# Altium project Блок вычислительный.PrjPcb (part 2 of 2)
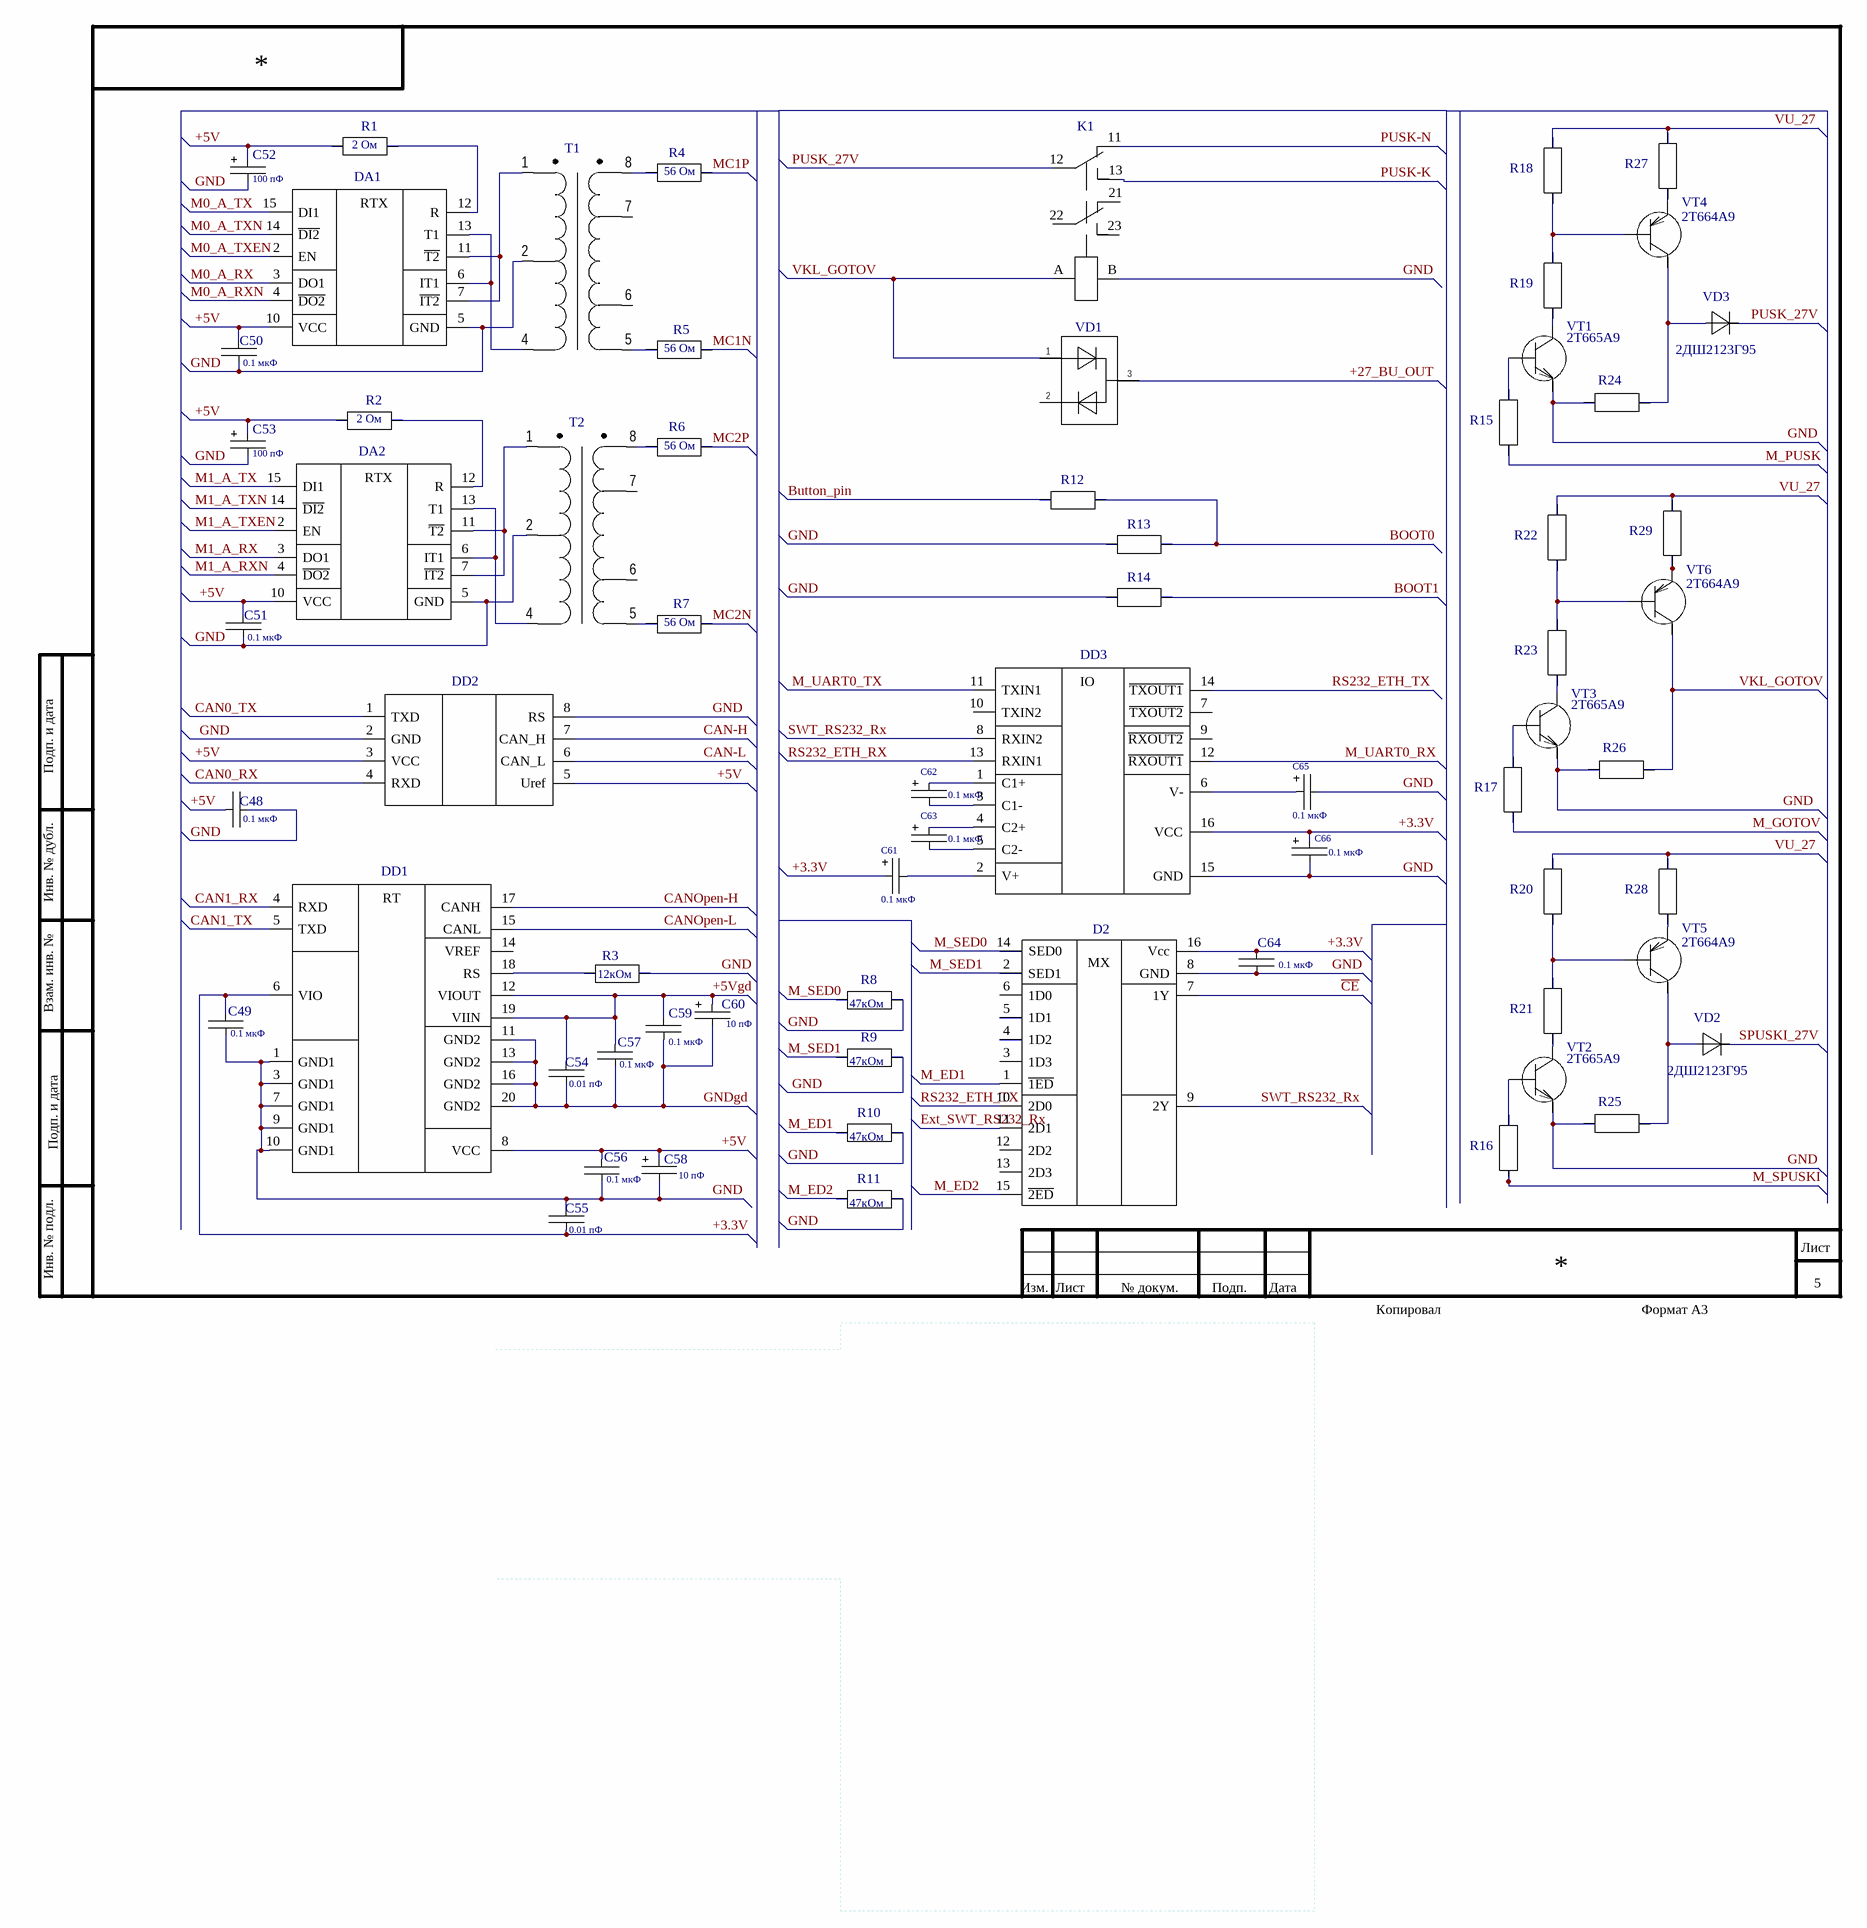
[diagram p5: InterfMCU.SchDoc]

## Nets that join several sheets
+1.2V: InternalConnection (XP13.5), MCU1 (66 pins)
+3.3V: InternalConnection (13 pins), MCU1 (70 pins), InterfMCU (8 pins)
GND: ExternalConnection (XP3.J XP6.H), InternalConnection (22 pins), MCU1 (101 pins), InterfMCU (39 pins)
+5V: InternalConnection (N51.1 N52.1 XP13.7 XS1.62), InterfMCU (14 pins)
+5VGD: InternalConnection (N53.1 N54.1 XP13.8 XS1.60), InterfMCU (6 pins)
+27_BU_OUT: InternalConnection (N49.1 N50.1 XP13.2), InterfMCU (VD1.3)
+27V_BU1-1: ExternalConnection (XP9.D), InternalConnection (X191.1)
+27V_BU1-2: ExternalConnection (XP9.E), InternalConnection (X192.1)
+27V_BU1-3: ExternalConnection (XP9.F), InternalConnection (X193.1)
+27V_BU2-1: ExternalConnection (XP9.Z), InternalConnection (X181.1)
+27V_BU2-2: ExternalConnection (XP9.mm), InternalConnection (X182.1)
+27V_BU2-3: ExternalConnection (XP9.tt), InternalConnection (X183.1)
+27V_BU3-1: ExternalConnection (XP9.S), InternalConnection (X196.1)
+27V_BU3-2: ExternalConnection (XP9.T), InternalConnection (X197.1)
+27V_BU3-3: ExternalConnection (XP9.U), InternalConnection (X198.1)
+27V_BU4-1: ExternalConnection (XP9.ii), InternalConnection (X186.1)
+27V_BU4-2: ExternalConnection (XP9.kk), InternalConnection (X187.1)
+27V_BU4-3: ExternalConnection (XP9.ss), InternalConnection (X188.1)
+27V_KMPOU-K: ExternalConnection (XP1.P), InternalConnection (VD5.2 X167.1)
+27V_KMPOU-K1: ExternalConnection (XP2.N), InternalConnection (X168.1)
+27V_KMPOU-K2: ExternalConnection (XP2.V), InternalConnection (X169.1)
+27V_KMPOU-N: ExternalConnection (XP1.A), InternalConnection (VD5.1 X164.1)
+27V_KMPOU-N1: ExternalConnection (XP3.N), InternalConnection (X165.1)
+27V_KMPOU-N2: ExternalConnection (XP3.V), InternalConnection (X166.1)
+27V_UV-K1: ExternalConnection (XP2.A), InternalConnection (X199.1)
+27V_UV-K2: ExternalConnection (XP2.P), InternalConnection (X200.1)
+27V_UV-N1: ExternalConnection (XP3.A), InternalConnection (X194.1)
+27V_UV-N2: ExternalConnection (XP3.P), InternalConnection (X195.1)
+27V_VM-K1: ExternalConnection (XP2.C), InternalConnection (X189.1)
+27V_VM-K2: ExternalConnection (XP2.L), InternalConnection (X190.1)
+27V_VM-N1: ExternalConnection (XP3.C), InternalConnection (X184.1)
+27V_VM-N2: ExternalConnection (XP3.L), InternalConnection (X185.1)
-27V_BU1-1: ExternalConnection (XP9.aa), InternalConnection (X217.1)
-27V_BU1-2: ExternalConnection (XP9.nn), InternalConnection (X218.1)
-27V_BU1-3: ExternalConnection (XP9.pp), InternalConnection (X219.1)
-27V_BU2-1: ExternalConnection (XP9.G), InternalConnection (X207.1)
-27V_BU2-2: ExternalConnection (XP9.bb), InternalConnection (X208.1)
-27V_BU2-3: ExternalConnection (XP9.cc), InternalConnection (X209.1)
-27V_BU3-1: ExternalConnection (XP9.hh), InternalConnection (X221.1)
-27V_BU3-2: ExternalConnection (XP9.qq), InternalConnection (X222.1)
-27V_BU3-3: ExternalConnection (XP9.rr), InternalConnection (X223.1)
-27V_BU4-1: ExternalConnection (XP9.R), InternalConnection (X212.1)
-27V_BU4-2: ExternalConnection (XP9.ff), InternalConnection (X213.1)
-27V_BU4-3: ExternalConnection (XP9.gg), InternalConnection (X214.1)
-27V_KMPOU-K: ExternalConnection (XP1.R), InternalConnection (X206.1)
-27V_KMPOU-N: ExternalConnection (XP1.U), InternalConnection (X205.1)
-27V_UV-K1: ExternalConnection (XP2.G), InternalConnection (X224.1)
-27V_UV-N: ExternalConnection (XP3.G), InternalConnection (X220.1)
-27V_VM-K1: ExternalConnection (XP2.R), InternalConnection (X215.1)
-27V_VM-K2: ExternalConnection (XP2.U), InternalConnection (X216.1)
-27V_VM-N1: ExternalConnection (XP3.R), InternalConnection (X210.1)
-27V_VM-N2: ExternalConnection (XP3.U), InternalConnection (X211.1)
~{BHE}: InternalConnection (D3.40), MCU2 (D1.T13)
~{BLE}: InternalConnection (D3.39), MCU2 (D1.V12)
~{CE}: InternalConnection (D3.6), MCU2 (D1.V8), InterfMCU (D2.7)
~{OE}: InternalConnection (D3.41), MCU2 (D1.V17)
~{WE}: InternalConnection (D3.17), MCU2 (D1.U17)
BOOT0: MCU1 (D1.P3), InterfMCU (R12.2 R13.2)
BOOT1: MCU1 (D1.P4), InterfMCU (R14.2)
Button_pin: InternalConnection (N13.1 N14.1 XS1.55), InterfMCU (R12.1)
CAN0_RX: MCU2 (D1.J5), InterfMCU (DD2.4)
CAN0_TX: MCU2 (D1.H3), InterfMCU (DD2.1)
CAN1_RX: MCU2 (D1.J2), InterfMCU (DD1.4)
CAN1_TX: MCU2 (D1.J4), InterfMCU (DD1.5)
CAN-H: ExternalConnection (XP3.K XP6.G), InternalConnection (N15.1 N16.1 XS1.53), InterfMCU (DD2.7)
CAN-L: ExternalConnection (XP3.H XP6.A), InternalConnection (N17.1 N18.1 XS1.54), InterfMCU (DD2.6)
CANOpen-H: ExternalConnection (XP10.B XP10.E), InternalConnection (N19.1 N20.1), InterfMCU (DD1.17)
CANOpen-L: ExternalConnection (XP10.A XP10.C), InternalConnection (N21.1 N22.1), InterfMCU (DD1.15)
EKRAN_1: ExternalConnection (XP1.S), InternalConnection (X201.1)
EKRAN_2: ExternalConnection (XP2.S), InternalConnection (X202.1)
EKRAN_3: ExternalConnection (XP3.S), InternalConnection (X203.1)
EKRAN_4: ExternalConnection (XP6.F), InternalConnection (X204.1)
EXT_A0: InternalConnection (D3.5 ), MCU2 (D1.P20)
EXT_A1: InternalConnection (D3.4), MCU2 (D1.N16)
EXT_A2: InternalConnection (D3.3), MCU2 (D1.N17)
EXT_A3: InternalConnection (D3.2), MCU2 (D1.N19)
EXT_A4: InternalConnection (D3.1), MCU2 (D1.N20)
EXT_A5: InternalConnection (D3.44), MCU2 (D1.M17)
EXT_A6: InternalConnection (D3.43), MCU2 (D1.M19)
EXT_A7: InternalConnection (D3.42), MCU2 (D1.M20)
EXT_A8: InternalConnection (D3.27), MCU2 (D1.L17)
EXT_A9: InternalConnection (D3.26), MCU2 (D1.L18)
EXT_A10: InternalConnection (D3.25), MCU2 (D1.L19)
EXT_A11: InternalConnection (D3.24), MCU2 (D1.L20)
EXT_A12: InternalConnection (D3.22), MCU2 (D1.K18)
EXT_A13: InternalConnection (D3.21), MCU2 (D1.K20)
EXT_A14: InternalConnection (D3.20), MCU2 (D1.J16)
EXT_A15: InternalConnection (D3.19), MCU2 (D1.J17)
EXT_A16: InternalConnection (D3.18), MCU2 (D1.U6)
EXT_D0: InternalConnection (D3.7), MCU2 (D1.S16)
EXT_D1: InternalConnection (D3.8), MCU2 (D1.S17)
EXT_D2: InternalConnection (D3.9), MCU2 (D1.U18)
EXT_D3: InternalConnection (D3.10), MCU2 (D1.V18)
EXT_D4: InternalConnection (D3.13), MCU2 (D1.V19)
EXT_D5: InternalConnection (D3.14), MCU2 (D1.V20)
EXT_D6: InternalConnection (D3.15), MCU2 (D1.T20)
EXT_D7: InternalConnection (D3.16), MCU2 (D1.T19)
EXT_D8: InternalConnection (D3.29), MCU2 (D1.S20)
EXT_D9: InternalConnection (D3.30), MCU2 (D1.S19)
EXT_D10: InternalConnection (D3.31), MCU2 (D1.R20)
EXT_D11: InternalConnection (D3.32), MCU2 (D1.R19)
EXT_D12: InternalConnection (D3.35), MCU2 (D1.Q20)
EXT_D13: InternalConnection (D3.36), MCU2 (D1.Q19)
EXT_D14: InternalConnection (D3.37), MCU2 (D1.P18)
EXT_D15: InternalConnection (D3.38), MCU2 (D1.P19)
Ext_SWT_RS232_Rx: InternalConnection (N41.1 N42.1 XS1.57), InterfMCU (D2.11)
GNDgd: ExternalConnection (XP10.D), InternalConnection (N1.1 N2.1 XP13.4), InterfMCU (8 pins)
INTERLOCK: ExternalConnection (XP10.G), InternalConnection (N65.1 N66.1 R35.1), MCU2 (D1.U8)
KORPUS: ExternalConnection (10 pins), InternalConnection (X226.1)
M0_A_RX: MCU2 (D1.K16), InterfMCU (DA1.3)
M0_A_RXN: MCU2 (D1.K17), InterfMCU (DA1.4)
M0_A_TX: MCU2 (D1.L16), InterfMCU (DA1.15 )
M0_A_TXEN: MCU2 (D1.M16), InterfMCU (DA1.2)
M0_A_TXN: MCU2 (D1.K19), InterfMCU (DA1.14)
M1_A_RX: MCU2 (D1.A20), InterfMCU (DA2.3)
M1_A_RXN: MCU2 (D1.A19), InterfMCU (DA2.4)
M1_A_TX: MCU2 (D1.G17), InterfMCU (DA2.15 )
M1_A_TXEN: MCU2 (D1.F3), InterfMCU (DA2.2)
M1_A_TXN: MCU2 (D1.F18), InterfMCU (DA2.14)
M_GOTOV: InternalConnection (N59.1 N60.1), MCU2 (D1.U7), InterfMCU (R17.1)
M_PUSK: InternalConnection (N63.1 N64.1), MCU2 (D1.V6), InterfMCU (R15.1)
M_SPUSKI: InternalConnection (N61.1 N62.1), MCU2 (D1.V7), InterfMCU (R16.1)
M_UART0_RX: MCU2 (D1.H4), InterfMCU (DD3.12)
M_UART0_TX: MCU2 (D1.H5), InterfMCU (DD3.11)
MC1N: ExternalConnection (X146.1 XP6.E), InternalConnection (N69.1 N70.1), InterfMCU (R5.2)
MC1P: ExternalConnection (X145.1 XP6.C), InternalConnection (N67.1 N68.1), InterfMCU (R4.2)
MC2N: InternalConnection (N73.1 N74.1 X228.1), InterfMCU (R7.2)
MC2P: InternalConnection (N71.1 N72.1 X227.1), InterfMCU (R6.2)
PUSK-K: ExternalConnection (XP1.V), InterfMCU (K1.13)
PUSK-N: ExternalConnection (XP1.N), InterfMCU (K1.11)
PUSK_27V: ExternalConnection (XP9.jj), InterfMCU (K1.12 VD3.3)
RESET: InternalConnection (N33.1 N34.1 XP14.10 XS1.45), MCU1 (D1.N4)
RS232_ETH_RX: InternalConnection (N43.1 N44.1 XS1.11), InterfMCU (DD3.13)
RS232_ETH_TX: InternalConnection (N45.1 N46.1 XS1.12), InterfMCU (D2.10 DD3.14)
SPUSKI_27V: ExternalConnection (XP9.X), InterfMCU (VD2.3)
SWT_RS232_Rx: InternalConnection (N47.1 N48.1 XS1.56), InterfMCU (D2.9 DD3.8)
TCK: InternalConnection (5 pins), MCU1 (D1.L4)
TDI: InternalConnection (5 pins), MCU1 (D1.N1)
TDO: InternalConnection (5 pins), MCU1 (D1.Q1)
TMS: InternalConnection (5 pins), MCU1 (D1.M4)
TRST: InternalConnection (5 pins), MCU1 (D1.M5)
VKL_BU: ExternalConnection (XP9.C), InternalConnection (VD5.3 XP13.1)
VKL_GOTOV: ExternalConnection (VD4.3 XP9.Y), InterfMCU (K1.A R26.1 VD1.1 VT6.2)
VU_27: ExternalConnection (XP2.T), InterfMCU (6 pins)